# EAGLE design MCU (EAGLE 9.6.2)
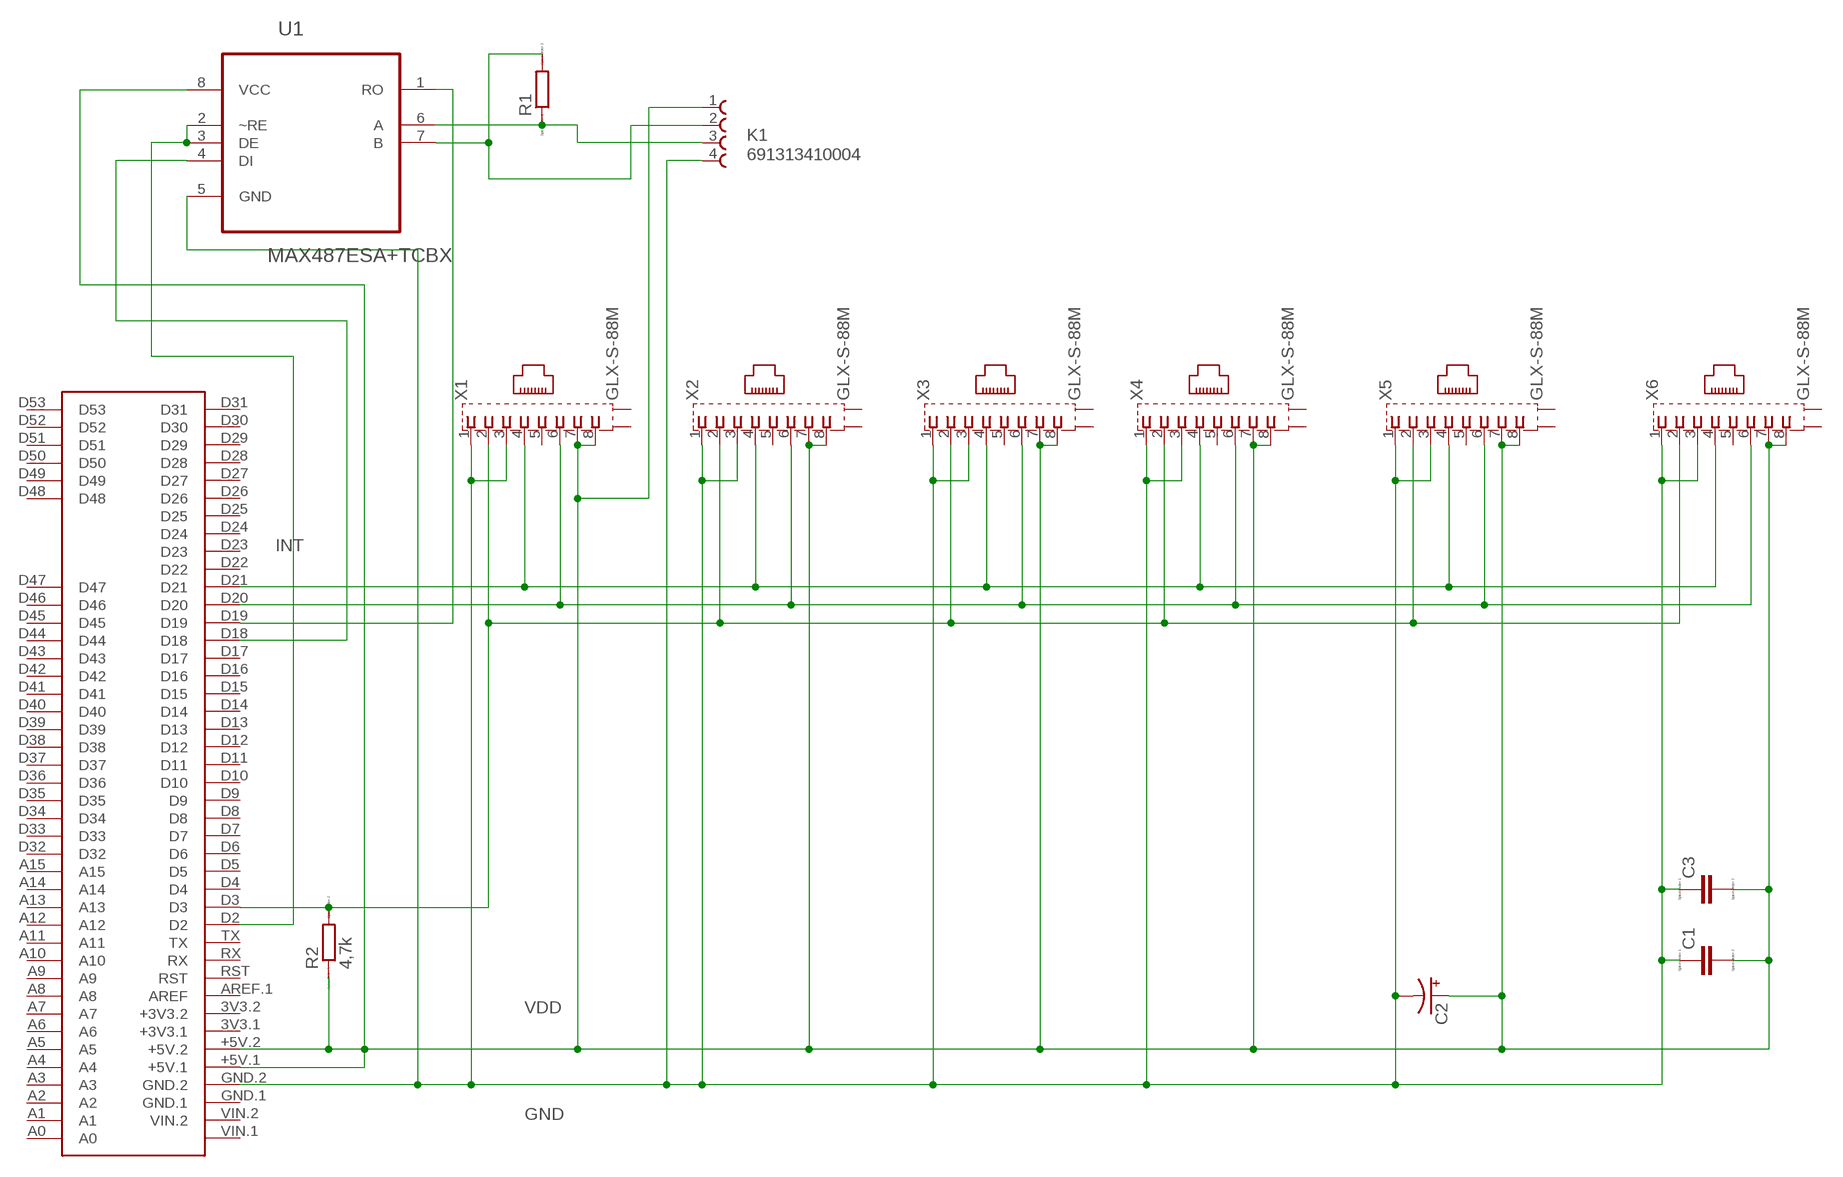
[diagram p0: schematic, sheet 1]

## Parts
C1  CC1206  [C1206]
C2  CPOL-US153CLV-0807  [153CLV-0807]
C3  CC1206  [C1206]
K1  691313410004  [691313410004]
R1  RR1206  [R1206]
R2  4,7k  RR1206  [R1206]
U1  MAX487ESA+TCBX  [SOIC127P600X175-8N]
U$1  MEGA2560_MIKRO  [MEGA2560_MIKRO]
X1  GLX-S-88M  [GLX-S-88M]
X2  GLX-S-88M  [GLX-S-88M]
X3  GLX-S-88M  [GLX-S-88M]
X4  GLX-S-88M  [GLX-S-88M]
X5  GLX-S-88M  [GLX-S-88M]
X6  GLX-S-88M  [GLX-S-88M]

## Nets
GND: C1.1 C2.- C3.1 K1.4 U1.5(GND) U$1.GND.2 X1.1 X1.3 X2.1 X2.3 X3.1 X3.3 X4.1 X4.3 X5.1 X5.3 X6.1 X6.3
INT: R2.2 U$1.D3 X1.2 X2.2 X3.2 X4.2 X5.2 X6.2
N$1: U1.4(DI) U$1.D18
N$2: U1.1(RO) U$1.D19
N$3: U1.2(~RE) U1.3(DE) U$1.D2
N$4: K1.3 R1.1 U1.6(A)
N$5: K1.2 R1.2 U1.7(B)
N$14: U$1.D20 X1.6 X2.6 X3.6 X4.6 X5.6 X6.6
N$15: U$1.D21 X1.4 X2.4 X3.4 X4.4 X5.4 X6.4
VDD: C1.2 C2.+ C3.2 K1.1 R2.1 U1.8(VCC) U$1.+5V.1 U$1.+5V.2 X1.7 X1.8 X2.7 X2.8 X3.7 X3.8 X4.7 X4.8 X5.7 X5.8 X6.7 X6.8
Unconnected: U$1.3V3.1(+3V3.1) U$1.3V3.2(+3V3.2) U$1.A0 U$1.A1 U$1.A2 U$1.A3 U$1.A4 U$1.A5 U$1.A6 U$1.A7 U$1.A8 U$1.A9 U$1.A10 U$1.A11 U$1.A12 U$1.A13 U$1.A14 U$1.A15 U$1.AREF.1(AREF) U$1.D4 U$1.D5 U$1.D6 U$1.D7 U$1.D8 U$1.D9 U$1.D10 U$1.D11 U$1.D12 U$1.D13 U$1.D14 U$1.D15 U$1.D16 U$1.D17 U$1.D22 U$1.D23 U$1.D24 U$1.D25 U$1.D26 U$1.D27 U$1.D28 U$1.D29 U$1.D30 U$1.D31 U$1.D32 U$1.D33 U$1.D34 U$1.D35 U$1.D36 U$1.D37 U$1.D38 U$1.D39 U$1.D40 U$1.D41 U$1.D42 U$1.D43 U$1.D44 U$1.D45 U$1.D46 U$1.D47 U$1.D48 U$1.D49 U$1.D50 U$1.D51 U$1.D52 U$1.D53 U$1.GND.1 U$1.RST U$1.RX U$1.TX U$1.VIN.1 U$1.VIN.2 X1.5 X1.S1 X1.S2 X2.5 X2.S1 X2.S2 X3.5 X3.S1 X3.S2 X4.5 X4.S1 X4.S2 X5.5 X5.S1 X5.S2 X6.5 X6.S1 X6.S2

## Library data of the parts
C1 C3 = eagle-ltspice:C: CAPACITOR, European symbol; SPICEMODEL: NONE; SPICEPREFIX: C
C2 = adafruit:CPOL-US: POLARIZED CAPACITOR, American symbol
K1 = Wurth_Elektronik_Electromechanic_Terminal_Blocks_Connectors_rev15c:691313410004: WR-TBL Serie 3134 - 7.62 mm Open Horizontal PCB Header , 4 Pins=>Code : Con_TBL_Pluggable_7.62_PCB_H_691313410004 <http://katalog.we-online.de/media/images/eican/Con_TBL_Pluggable_7.62_PCB_H_6913134100xx_pf2.jpg> Details see: http://katalog.we-online.de/en/em/691_313_410_0xx Created 2014-06-25, Karrer Zheng 2014 (C) Würth Elektronik
R1 R2 = eagle-ltspice:R: RESISTOR, European symbol; SPICEMODEL: NONE; SPICEPREFIX: R
U1 = MAX487ESA_TCBX:MAX487ESA+TCBX: Low-Power, Slew-Rate-Limited RS-485/RS-422 Transceivers Check prices <https://pricing.snapeda.com/parts/MAX487ESA%2BTCBX/Maxim%20Integrated/view-part?ref=eda>; AVAILABILITY: Warning; DESCRIPTION: 1/1 Transceiver Half RS422, RS485 8-SOIC; MF: Maxim Integrated; MP: MAX487ESA+TCBX; PACKAGE: SOIC-8 Maxim Integrated; PRICE: None; PURCHASE-URL: https://pricing.snapeda.com/search/part/MAX487ESA+TCBX/?ref=eda
U$1 = MIKRO_MEGA2560:MEGA2560_MIKRO: Arduino Mega2560 pro robotDyn, create by mikroavr.com
X1-X6 = con-kycon:GLX-S-88M: Mod. Jack, Right Angle, 8 posiotion, 8 contatcs RJ45 Source: GLX-S-88M.pdf; OC_FARNELL: unknown; OC_NEWARK: unknown

## Board
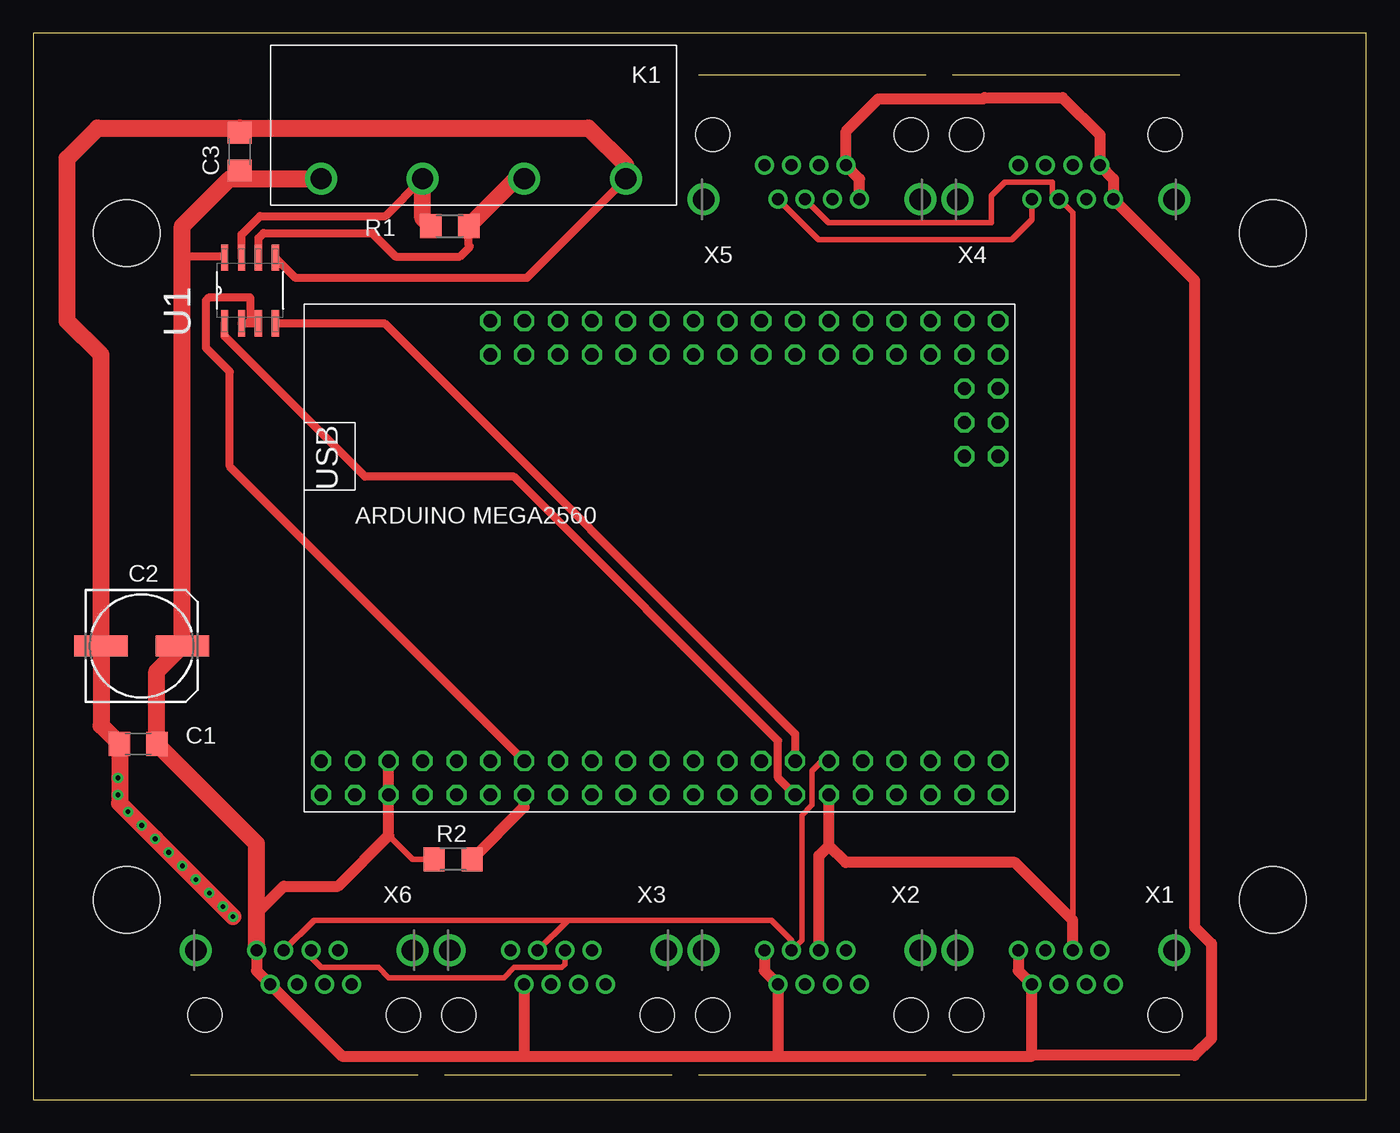
[diagram p1: board, top side]
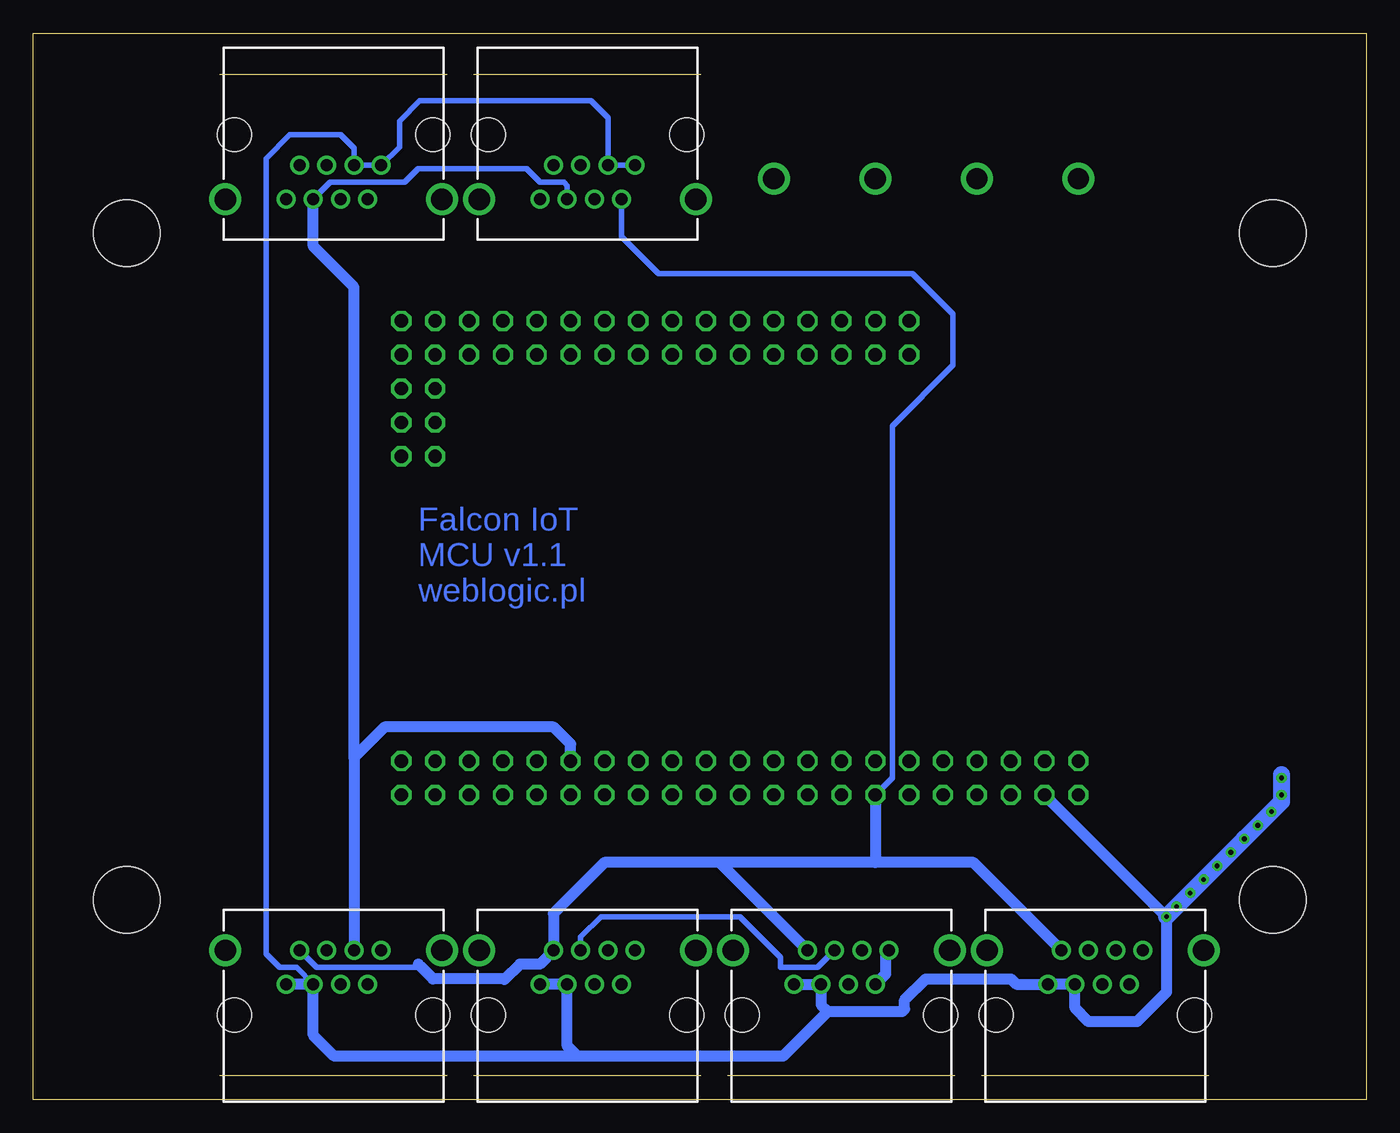
[diagram p2: board, bottom side, seen from below]

Size 100 x 80 mm. Coordinates in mm from the lower left corner, seen from the top.
Outline: 0,0 100,0 100,80 0,80 0,0
Copper layers (1*16): Top 0.035mm / dielectric 1.5mm / Bottom 0.035mm
Design rules "default": minimum track width 6mil, minimum drill 0.35mm, track to track 6mil, track to pad 6mil, pad to pad 6mil, via to via 6mil, smd to smd 6mil, copper to edge 40mil, drill to drill 6mil, minimum pad ring 10mil, minimum via ring 8mil, stop-mask expansion 4mil, vias tented up to drill 0mil, thermal gap 10mil
Holes 5 mm at 7,15 7,65 93,65 93,15

### Footprints (pad centres in the part's own frame; a part is rotated, then mirrored left to right if it is on the bottom)
C1206 = smd 1.6 x 1.8: 1 -1.4,0; 2 1.4,0
153CLV-0807 = smd 4 x 1.6: + 3.05,0; - -3.05,0
691313410004 = drill 1.6: 1 -22.86,0; 2 -15.24,0; 3 -7.62,0; 4 0,0
R1206 = smd 1.6 x 1.803: 1 -1.422,0; 2 1.422,0
SOIC127P600X175-8N = smd 1.981 x 0.533: 1 -2.464,1.905; 2 -2.464,0.635; 3 -2.464,-0.635; 4 -2.464,-1.905; 5 2.464,-1.905; 6 2.464,-0.635; 7 2.464,0.635; 8 2.464,1.905
MEGA2560_MIKRO = drill 1 octagon: 3V3.1 -26.67,-17.78; 3V3.2 -26.67,-20.32; +5V.1 -29.21,-17.78; +5V.2 -29.21,-20.32; A0 -21.59,15.24; A1 -21.59,12.7; A2 -19.05,15.24; A3 -19.05,12.7; A4 -16.51,15.24; A5 -16.51,12.7; A6 -13.97,15.24; A7 -13.97,12.7; A8 -11.43,15.24; A9 -11.43,12.7; A10 -8.89,15.24; A11 -8.89,12.7; A12 -6.35,15.24; A13 -6.35,12.7; A14 -3.81,15.24; A15 -3.81,12.7; AREF.1 -24.13,-17.78; D2 -19.05,-17.78; D3 -19.05,-20.32; D4 -16.51,-17.78; D5 -16.51,-20.32; D6 -13.97,-17.78; D7 -13.97,-20.32; D8 -11.43,-17.78; D9 -11.43,-20.32; D10 -8.89,-17.78; D11 -8.89,-20.32; D12 -6.35,-17.78; D13 -6.35,-20.32; D14 -3.81,-17.78; D15 -3.81,-20.32; D16 -1.27,-17.78; D17 -1.27,-20.32; D18 1.27,-17.78; D19 1.27,-20.32; D20 3.81,-17.78; D21 3.81,-20.32; D22 6.35,-17.78; D23 6.35,-20.32; D24 8.89,-17.78; D25 8.89,-20.32; D26 11.43,-17.78; D27 11.43,-20.32; D28 13.97,-17.78; D29 13.97,-20.32; D30 16.51,-17.78; D31 16.51,-20.32; D32 -1.27,15.24; D33 -1.27,12.7; D34 1.27,15.24; D35 1.27,12.7; D36 3.81,15.24; D37 3.81,12.7; D38 6.35,15.24; D39 6.35,12.7; D40 8.89,15.24; D41 8.89,12.7; D42 11.43,15.24; D43 11.43,12.7; D44 13.97,15.24; D45 13.97,12.7; D46 16.51,15.24; D47 16.51,12.7; D48 16.51,10.16; D49 13.97,10.16; D50 16.51,7.62; D51 13.97,7.62; D52 16.51,5.08; D53 13.97,5.08; GND.1 -31.75,-17.78; GND.2 -31.75,-20.32; RST -24.13,-20.32; RX -21.59,-17.78; TX -21.59,-20.32; VIN.1 -34.29,-17.78; VIN.2 -34.29,-20.32
GLX-S-88M = drill 0.9 pad 1.422: 1 -3.57,-2.3; 2 -2.55,-4.84; 3 -1.53,-2.3; 4 -0.51,-4.84; 5 0.51,-2.3; 6 1.53,-4.84; 7 2.55,-2.3; 8 3.57,-4.84 | drill 1.6 pad 2.184: S1 -8.125,-4.84; S2 8.125,-4.84 | hole 2.55: -7.44,0; 7.44,0

### Placement (x,y rotation side)
C1  7.87,26.67 0 top
C2  8.13,34.04 0 top
C3  15.49,71.12 270 top
K1  44.45,69.09 0 top
R1  31.24,65.53 180 top
R2  31.5,18.03 0 top
U1  16.26,60.71 90 top
U$1  55.88,43.18 0 top
X1  77.47,6.35 180 top
X2  58.42,6.35 180 top
X3  39.37,6.35 180 top
X4  77.47,72.39 0 top
X5  58.42,72.39 0 top
X6  20.32,6.35 180 top

### Tracks (layer width: path | path; a pad name or v marks a point on that pad's centre or on a via)
GND  (via drill 0.35)
  Top 0.508: C3.1 15.49,72.9
  Top 0.61: U1.5 19.68,61.65 37.01,61.65 K1.4
  Top 1.27: v14.99,13.72 v14.22,14.48 v13.21,15.49 v12.19,16.51 v11.18,17.53 v10.16,18.54 v9.14,19.56 v8.13,20.57 v7.11,21.59 6.47,22.23 C1.1 5.08,28.07 C2.- 5.08,55.88 2.54,58.42 2.54,70.61 4.83,72.9 15.49,72.9 41.66,72.9 44.45,70.1 K1.4
  Bottom 0.406: X1.3 80.26,9.91 81.53,9.91 82.55,10.92 82.55,70.61 80.77,72.39 76.96,72.39 75.94,71.37 X4.3 X4.1 72.52,71.47 72.52,73.42 71.02,74.93 58.17,74.93 56.89,73.65 X5.3 X5.1
  Bottom 0.813: X3.1 X3.3 40.9,7.12 40.39,6.6 | 40.39,6.6 34.8,6.6 34.63,6.78 34.63,7.47 33.05,9.05 26.64,9.05 26.25,8.65 X6.1 X6.3 21.85,6.86 20.83,5.84 17.2,5.84 14.99,8.06 v14.99,13.72 U$1.GND.2 | 40.39,6.6 43.74,3.25 59.18,3.25 | 59.18,3.25 59.95,4.02 X2.3 X2.1 | 59.18,3.25 77.42,3.25 79,4.83 X1.3 X1.1
  Bottom 1.27: v14.99,13.72 v14.22,14.48 v13.21,15.49 v12.19,16.51 v11.18,17.53 v10.16,18.54 v9.14,19.56 v8.13,20.57 v7.11,21.59 6.35,22.35 v6.35,22.86 v6.35,24.13 6.35,24.38
INT
  Top 0.406: X5.2 58.9,64.52 73.41,64.52 74.92,66.03 X4.2
  Top 0.813: R2.2 36.83,21.95 U$1.D3
  Bottom 0.406: X1.2 78.74,9.91 70.87,9.91 | U$1.D3 35.56,24.13 35.56,50.55 30.99,55.12 30.99,58.93 34.04,61.98 53.09,61.98 55.87,64.76 X5.2
  Bottom 0.813: X3.2 48.51,17.78 | 48.51,17.78 57.15,17.78 60.97,13.96 X2.2 62,10.16 63.5,10.16 64.68,8.98 64.74,9.05 70.01,9.05 70.87,9.91 71.12,10.16 | X6.2 29.46,17.78 36.83,17.78 | 36.83,17.78 48.51,17.78 | U$1.D3 36.83,17.78
N$1
  Top 0.61: U1.4 26.34,58.24 57.15,27.43 U$1.D18
N$2
  Top 0.61: U$1.D19 55.88,24.13 55.88,26.92 36.07,46.74 24.89,46.74 14.35,57.28 U1.1
N$3
  Top 0.61: U1.2 16.26,58.24 | 16.26,58.24 U1.3 | 16.26,58.24 16.26,60.2 13.21,60.2 12.95,59.94 12.95,56.39 14.73,54.61 14.73,47.5 U$1.D2
N$4
  Top 0.61: U1.6 16.89,64.64 17.27,65.02 25.4,65.02 27.18,63.25 32,63.25 32.77,64.01 32.66,64.11 R1.1
  Top 1.27: R1.1 36.22,69.09 K1.3
N$5
  Top 0.61: U1.7 15.62,64.9 17.02,66.29 26.42,66.29 K1.2
  Top 1.27: R1.2 29.21,66.14 K1.2
N$14
  Top 0.406: U$1.D20 59.18,25.4 58.42,24.64 58.42,22.1 57.66,21.34 57.66,11.96 X2.6 56.89,11.94 55.37,13.46 40.11,13.46 | X3.6 40.11,13.46 | X6.6 21.06,13.46 40.11,13.46
  Bottom 0.406: X4.6 77.72,68.83 72.14,68.83 71.12,69.85 62.99,69.85 61.98,68.83 60.2,68.83 59.95,68.59 X5.6
  Bottom 0.813: U$1.D20 59.69,26.67 60.96,27.94 73.66,27.94 75.94,25.66 | 75.94,25.66 X1.6 | 75.94,25.66 75.94,60.95 79,64.01 X4.6
N$15
  Top 0.406: X5.4 59.67,65.79 71.88,65.79 71.88,67.82 72.9,68.83 76.45,68.83 76.45,68.06 X4.4 77.98,66.53 77.98,13.46 | X6.4 20.83,10.67 21.59,9.91 25.91,9.91 26.67,9.14 35.31,9.14 36.07,9.91 39.62,9.91 39.88,10.16 X3.4
  Top 0.813: X1.4 77.98,13.46 73.66,17.78 60.96,17.78 59.69,19.05 | 59.69,19.05 U$1.D21 | X2.4 58.93,18.29 59.69,19.05
  Bottom 0.406: X3.4 41.16,9.91 43.94,9.91 43.94,10.67 46.99,13.72 57.4,13.72 58.93,12.19 X2.4
VDD
  Top 0.406: R2.1 28.45,18.03 26.67,19.81
  Top 0.508: C3.2 15.49,69.09
  Top 0.61: U1.8 14.28,63.25 11.18,63.25
  Top 0.813: X2.8 54.85,9.67 X2.7 55.87,3.26 55.88,3.25 | X1.8 73.9,9.67 X1.7 74.93,3.25 | 36.83,3.25 23.17,3.25 X6.7 16.75,9.67 X6.8 16.75,13.96 18.8,16 22.86,16 26.67,19.81 U$1.+5V.2 U$1.+5V.1 | 36.83,3.25 55.88,3.25 | 55.88,3.25 74.93,3.25 | X3.7 36.82,3.26 36.83,3.25 | X5.8 61.99,69.07 X5.7 60.97,72.65 63.4,75.09 71.28,75.09 71.37,75.18 77.22,75.18 80.02,72.38 X4.7 81.04,69.07 X4.8 87.12,61.47 87.12,12.95 88.39,11.68 88.39,4.57 87.12,3.3 74.98,3.3 74.93,3.25
  Top 1.27: X6.8 16.75,19.19 C1.2 9.27,32.13 C2.+ 11.18,63.25 11.18,65.53 14.73,69.09 15.49,69.09 K1.1
  Bottom 0.813: X3.8 36.07,10.92 36.07,9.4 X3.7

### Text on the board
Bottom: Falcon IoT / MCU v1.1 / weblogic.pl